# Altium schematic sheet Sensors.SchDoc
size A4; SheetNumber: 9; SheetTotal: 9
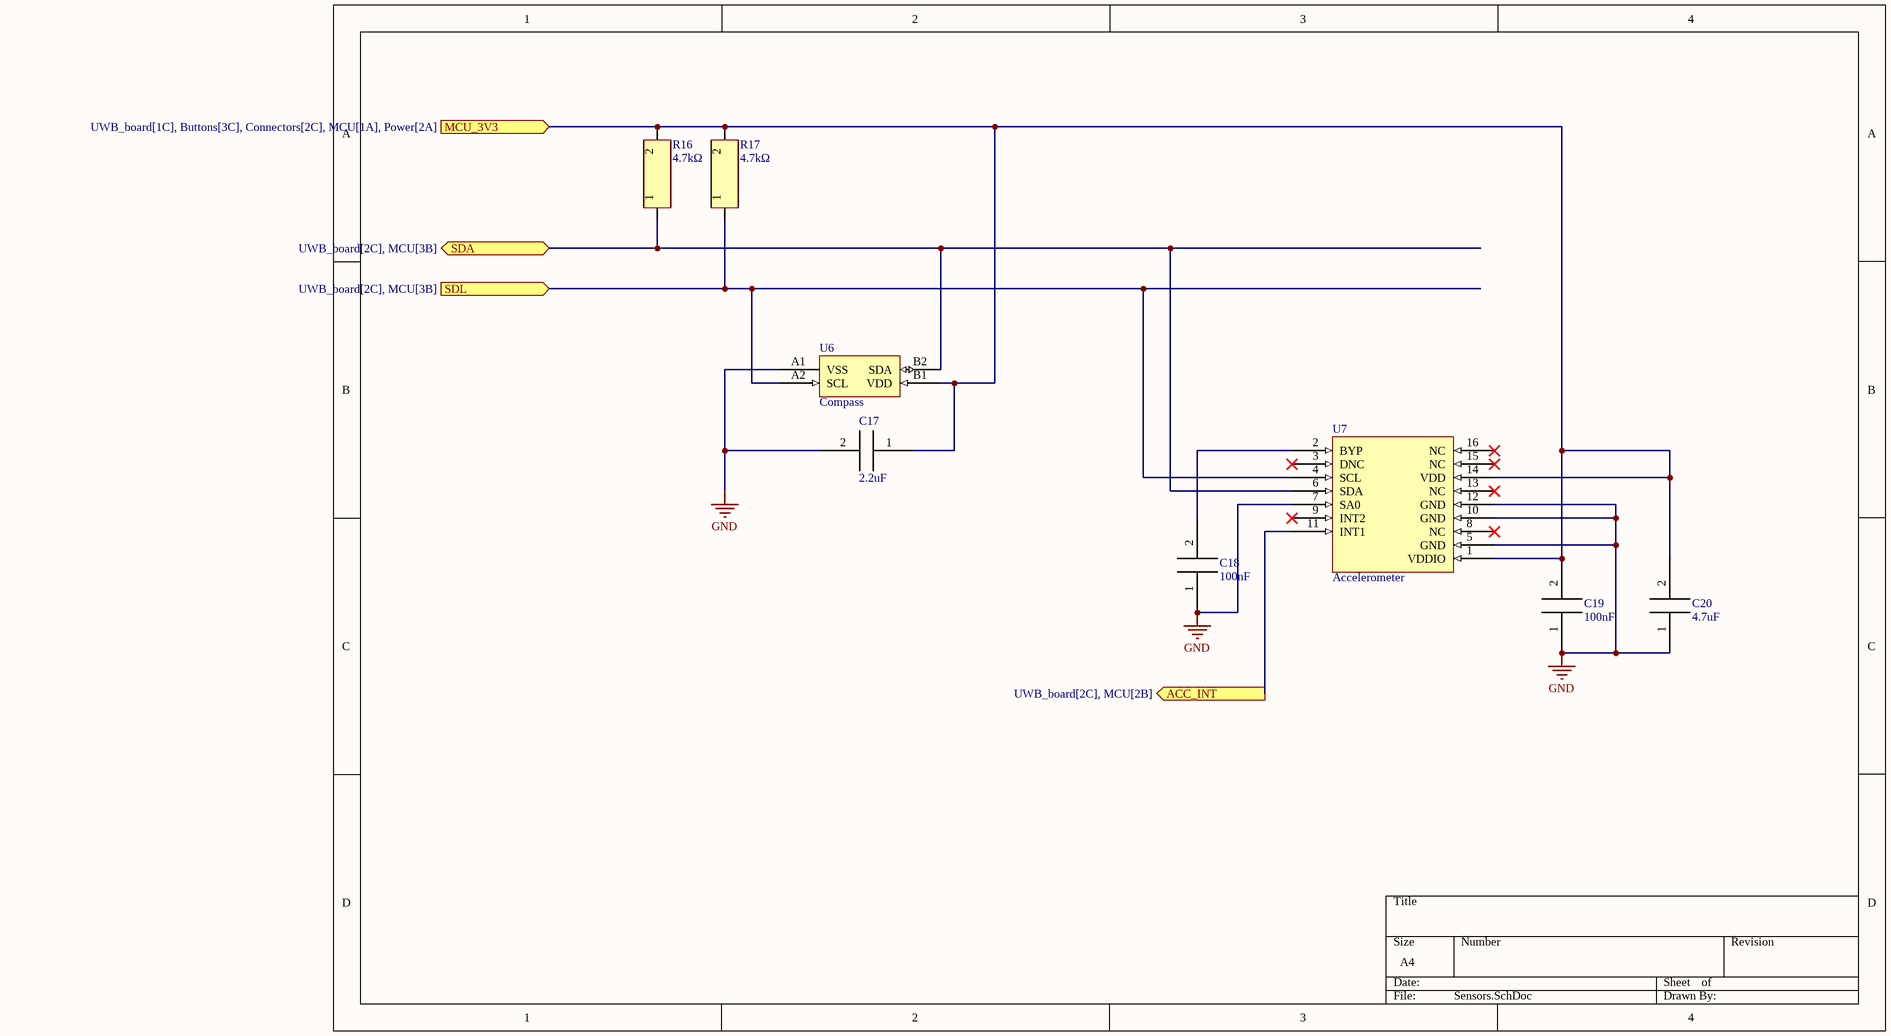
[diagram p0: Sensors.SchDoc]

## Parts
C17  2.2uF  [0603_cap]
C18  100nF  [0603_cap]
C19  100nF  [0603_cap]
C20  4.7uF  [0603_cap]
R16  value 4.7kΩ  [0603_res]  (hidden comment: 4.7k)
R17  value 4.7kΩ  [0603_res]  (hidden comment: 4.7k)
U6  Compass  [BGA4C40P2X2_79X79X58]
U7  Accelerometer  [QFN50P300X300X100-16N]

## Ports
ACC_INT (out, see UWB_board[2C], MCU[2B]), MCU_3V3 (in, see UWB_board[1C], Buttons[3C], Connectors[2C], MCU[1A], Power[2A]), SDA (bidir, see UWB_board[2C], MCU[3B]), SDL (in, see UWB_board[2C], MCU[3B])

## Nets
GND: C17.2 C18.1 C19.1 C20.1 U6.A1(VSS) U7.5(GND) U7.7(SA0) U7.10(GND) U7.12(GND)
ACC_INT: U7.11(INT1) ; port ACC_INT
MCU_3V3: C17.1 C19.2 C20.2 R16.2 R17.2 U6.B1(VDD) U7.1(VDDIO) U7.14(VDD) ; port MCU_3V3
SDA: R16.1 U6.B2(SDA) U7.6(SDA) ; port SDA
SDL: R17.1 U6.A2(SCL) U7.4(SCL) ; port SDL
NetC18_2: C18.2 U7.2(BYP)

Not connected (* = marked no-connect by the designer): U7 3(DNC)* 8(NC)* 9(INT2)* 13(NC)* 15(NC)* 16(NC)*

## Library data of the parts
C17 = CL10A225KO8NNNC: 2.2uF 16V X5R ±10% 0603 Multilayer Ceramic Capacitors MLCC - SMD/SMT ROHS; LCSC Part #: C23630; Value: 2.2uF
C18 C19 = CC0603KRX7R9BB104: 100nF 50V X7R ±10% 0603 Multilayer Ceramic Capacitors MLCC - SMD/SMT ROHS; LCSC Part #: C14663; Value: 100nF
C20 = CL10A475KO8NNNC: 4.7uF 50V X7R ±10% 0603 Multilayer Ceramic Capacitors MLCC - SMD/SMT ROHS; LCSC Part #: C19666; Value: 4.7uF
R16 R17 = 0603WAF4701T5E: 4.7kΩ -55℃~+155℃ 100mW 75V Thick Film Resistor ±1% ±100ppm/℃ 0603 Chip Resistor - Surface Mount ROHS; LCSC Part #: C23162
U6 = QMC6309: -40℃~+85℃ 16bit 2.5V~3.6V 6uA I2C ±3.2mT ±3.2mT WLCSP-4(0.8x0.8) 3D Magnetic Sensors ROHS; LCSC Part #: C5439871
U7 = MMA8451QR1: -40℃~+85℃ 1.8uA 1.95V~3.6V 14bit Accelerometer I2C X,Y,Z ±8g QFN-16(3x3) Accelerometers ROHS; LCSC Part #: C118083